# EAGLE design X16-Pi-Shield (EAGLE 9.6.2)

## Sheet 1 of 4
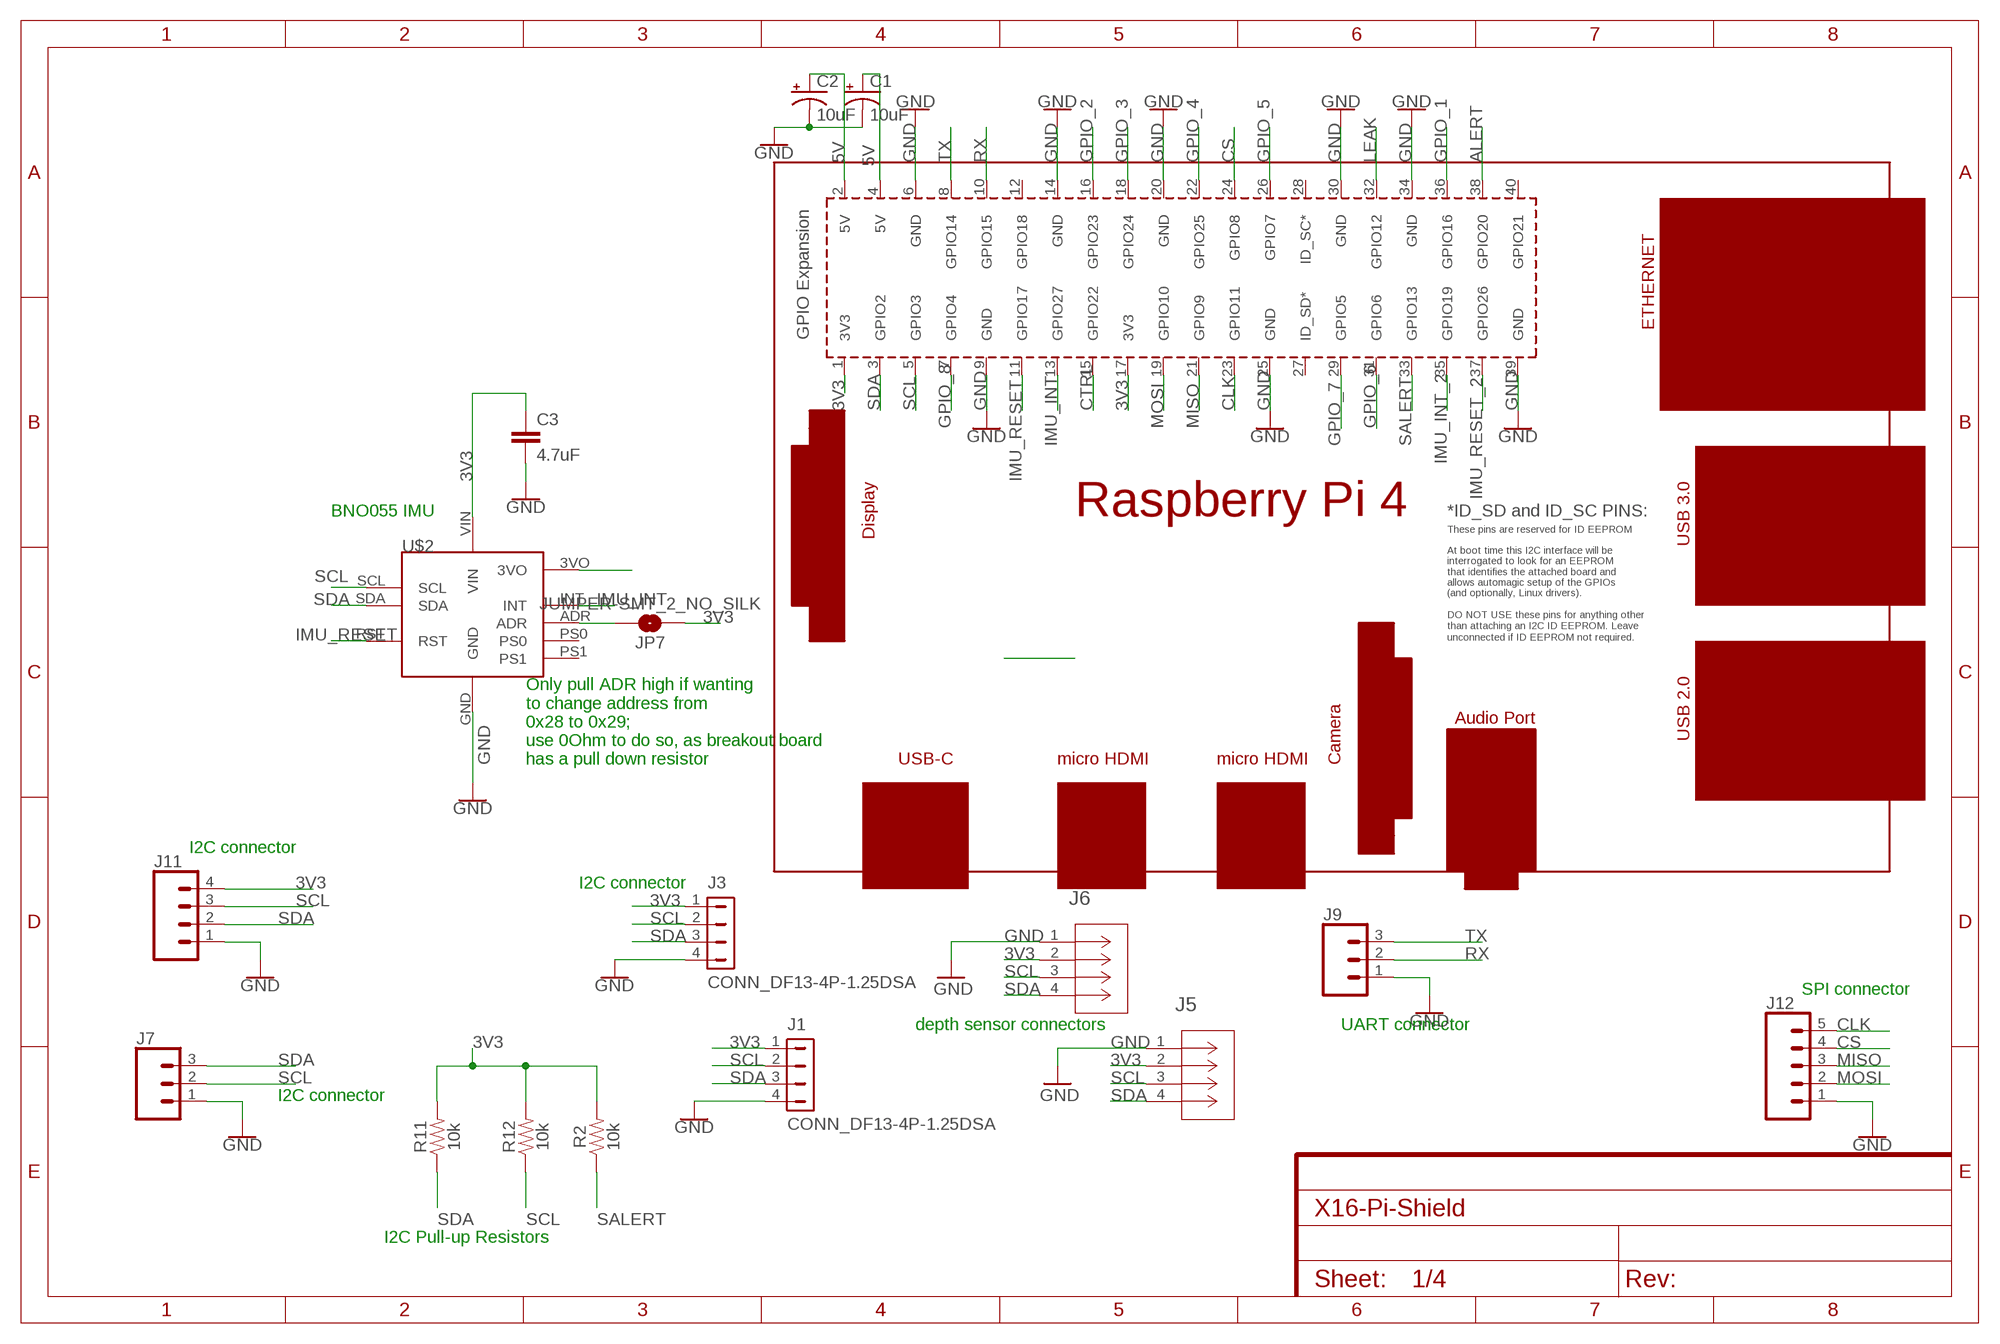
[diagram p0: schematic, sheet 1]

### Parts
C1  10uF  10UF-POLAR-0603-6.3V-20%(TANT)  [0603-POLAR]
C2  10uF  10UF-POLAR-0603-6.3V-20%(TANT)  [0603-POLAR]
C3  4.7uF  4.7UF0603  [0603]
J1  CONN_DF13-4P-1.25DSA  [DF13-4P-1.25DSA]
J3  CONN_DF13-4P-1.25DSA  [DF13-4P-1.25DSA]
J5  BM04B-GHS-TBT  [CONN_BM04B-GHS-TBT_JST]
J6  BM04B-GHS-TBT  [CONN_BM04B-GHS-TBT_JST]
J7  CONN_03  [1X03]
J9  CONN_03  [1X03]
J11  CONN_04  [1X04]
J12  CONN_05  [1X05]
JP7  JUMPER-SMT_2_NO_SILK  [SMT-JUMPER_2_NO_SILK]
R2  10k  RESISTOR0603  [0603]
R11  10k  RESISTOR0603  [0603]
R12  10k  RESISTOR0603  [0603]
U$1  RPI4  [RPI4]
U$2  CONN_ADAFRUIT-BNO055  [ADAFRUIT-BNO055]

### Nets
3V3: C3.1 J1.1 J3.1 J5.2 J6.2 J11.4 JP7.1 R2.2 R11.2 R12.2 U$1.1(3V3) U$1.17(3V3) U$2.VIN ; also sheet 2,4
5V: C1.+ C2.+ U$1.2(5V) U$1.4(5V) ; also sheet 2
ALERT: U$1.38(GPIO20) ; also sheet 2
CLK: J12.5 U$1.23(GPIO11) ; also sheet 3
CS: J12.4 U$1.24(GPIO8) ; also sheet 3
CTRL: U$1.15(GPIO22) ; also sheet 3
GND: C1.- C2.- C3.2 J1.4 J3.4 J5.1 J6.1 J7.1 J9.1 J11.1 J12.1 U$1.6(GND) U$1.9(GND) U$1.14(GND) U$1.20(GND) U$1.25(GND) U$1.30(GND) U$1.34(GND) U$1.39(GND) U$2.GND ; also sheet 2,3,4
GPIO_1: U$1.36(GPIO16) ; also sheet 3
GPIO_2: U$1.16(GPIO23) ; also sheet 3
GPIO_3: U$1.18(GPIO24) ; also sheet 3
GPIO_4: U$1.22(GPIO25) ; also sheet 3
GPIO_5: U$1.26(GPIO7) ; also sheet 3
GPIO_6: U$1.31(GPIO6) ; also sheet 3
GPIO_7: U$1.29(GPIO5) ; also sheet 3
GPIO_8: U$1.7(GPIO4) ; also sheet 3
IMU_INT: U$1.13(GPIO27) U$2.INT
IMU_INT_2: U$1.35(GPIO19) ; also sheet 4
IMU_RESET: U$1.11(GPIO17) U$2.RST
IMU_RESET_2: U$1.37(GPIO26) ; also sheet 4
LEAK: U$1.32(GPIO12) ; also sheet 4
MISO: J12.3 U$1.21(GPIO9) ; also sheet 3
MOSI: J12.2 U$1.19(GPIO10) ; also sheet 3
N$3: U$2.3VO
N$17: JP7.2 U$2.ADR
RX: J9.2 U$1.10(GPIO15)
SALERT: R2.1 U$1.33(GPIO13) ; also sheet 3
SCL: J1.2 J3.2 J5.3 J6.3 J7.2 J11.3 R12.1 U$1.5(GPIO3) U$2.SCL ; also sheet 2,3,4
SDA: J1.3 J3.3 J5.4 J6.4 J7.3 J11.2 R11.1 U$1.3(GPIO2) U$2.SDA ; also sheet 2,3,4
TX: J9.3 U$1.8(GPIO14)
Unconnected: U$1.12(GPIO18) U$1.27(ID_SD*) U$1.28(ID_SC*) U$1.40(GPIO21) U$2.PS0 U$2.PS1

### Notes on the sheet
- BNO055 IMU
- Only pull ADR high if wanting
  to change address from 
  0x28 to 0x29;
  use 0Ohm to do so, as breakout board
  has a pull down resistor
- I2C connector
- I2C connector
- SPI connector
- depth sensor connectors | UART connector
- I2C connector
- I2C Pull-up Resistors

## Sheet 2 of 4
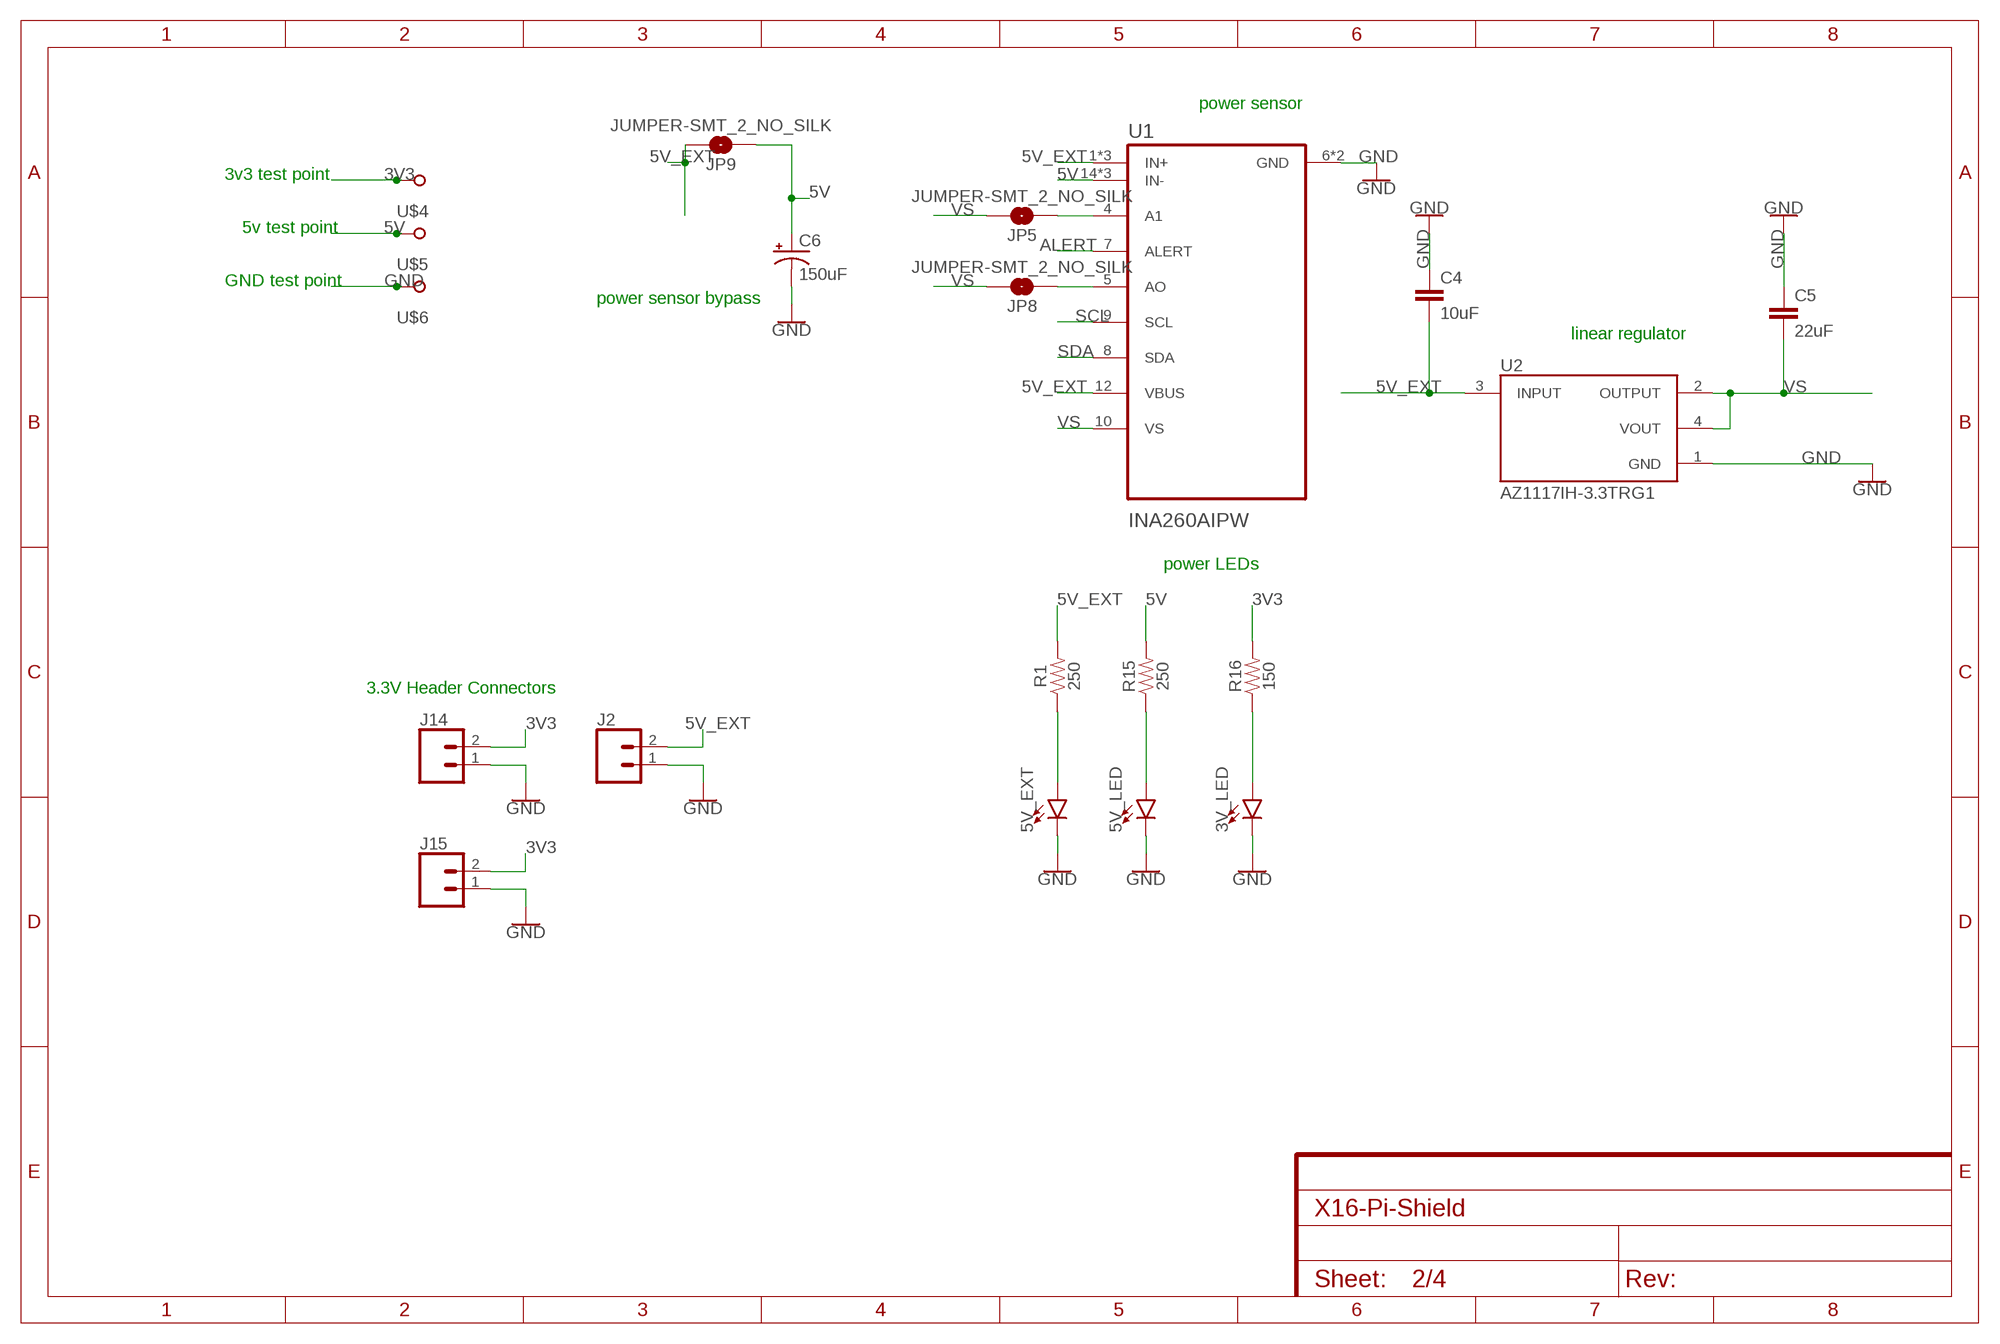
[diagram p1: schematic, sheet 2]

### Parts
3V_LED  LEDCHIPLED_0805  [CHIPLED_0805]
5V_EXT  LEDCHIPLED_0805  [CHIPLED_0805]
5V_LED  LEDCHIPLED_0805  [CHIPLED_0805]
C4  10uF  2.2UF-0603-10V-20%  [0603]
C5  22uF  2.2UF-0603-10V-20%  [0603]
C6  150uF  C-TANTALUM(10UF_150UF)  [2917(7343-31-METRIC)]
J2  CONN_02  [1X02]
J14  CONN_02  [1X02]
J15  CONN_02  [1X02]
JP5  JUMPER-SMT_2_NO_SILK  [SMT-JUMPER_2_NO_SILK]
JP8  JUMPER-SMT_2_NO_SILK  [SMT-JUMPER_2_NO_SILK]
JP9  JUMPER-SMT_2_NO_SILK  [SMT-JUMPER_2_NO_SILK]
R1  250  RESISTOR0603  [0603]
R15  250  RESISTOR0603  [0603]
R16  150  RESISTOR0603  [0603]
U1  INA260AIPW  [SOP65P640X120-16N]
U2  AZ1117IH-3.3TRG1  [SOT230P700X185-4N]
U$4  TESTPOINT_5.04MM  [TESTPOINT_5.04MM]
U$5  TESTPOINT_5.04MM  [TESTPOINT_5.04MM]
U$6  TESTPOINT_5.04MM  [TESTPOINT_5.04MM]

### Nets
3V3: J14.2 J15.2 R16.2 U$4.TP ; also sheet 1,4
5V: C6.+ JP9.1 R15.2 U1.14(IN-) U1.15(IN-) U1.16(IN-) U$5.TP ; also sheet 1
5V_EXT: C4.2 J2.2 JP9.2 R1.2 U1.1(IN+) U1.2(IN+) U1.3(IN+) U1.12(VBUS) U2.3(INPUT) ; also sheet 3
ALERT: U1.7(ALERT) ; also sheet 1
GND: 3V_LED.C 5V_EXT.C 5V_LED.C C4.1 C5.1 C6.- J2.1 J14.1 J15.1 U1.6(GND) U1.11(GND) U2.1(GND) U$6.TP ; also sheet 1,3,4
N$1: JP5.1 U1.4(A1)
N$2: JP8.1 U1.5(AO)
N$6: 5V_EXT.A R1.1
N$7: 5V_LED.A R15.1
N$9: 3V_LED.A R16.1
SCL: U1.9(SCL) ; also sheet 1,3,4
SDA: U1.8(SDA) ; also sheet 1,3,4
VS: C5.2 JP5.2 JP8.2 U1.10(VS) U2.2(OUTPUT) U2.4(VOUT)

### Notes on the sheet
- power sensor
- 3v3 test point
- 5v test point
- GND test point
- power sensor bypass
- linear regulator
- power LEDs
- 3.3V Header Connectors

## Sheet 3 of 4
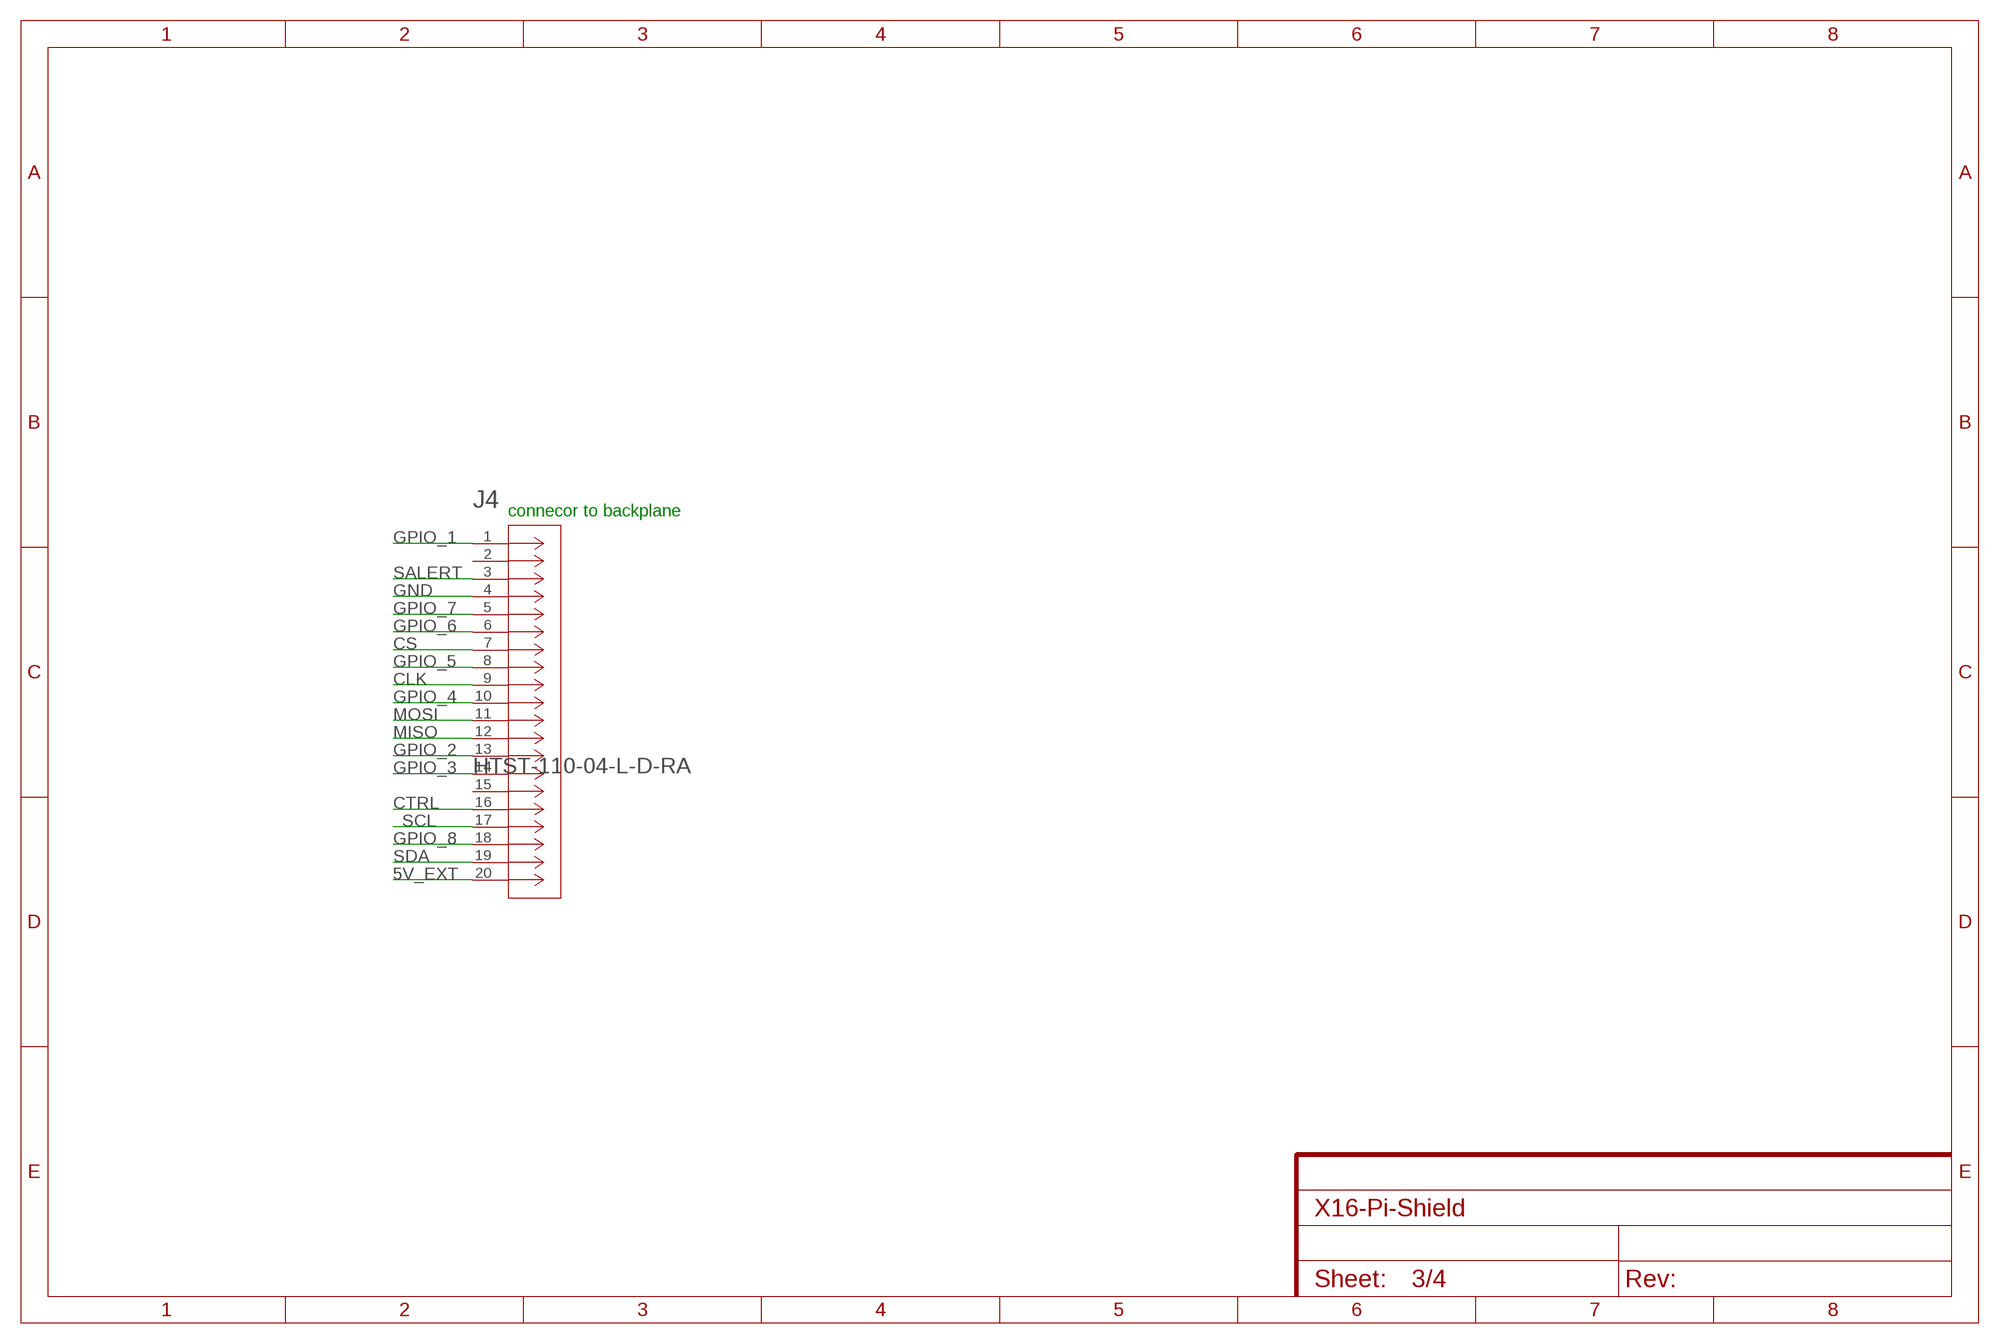
[diagram p2: schematic, sheet 3]

### Parts
J4  HTST-110-04-L-D-RA  [CONN_HTST-110-04/05-X-D-RA_SAI]

### Nets
5V_EXT: J4.20 ; also sheet 2
CLK: J4.9 ; also sheet 1
CS: J4.7 ; also sheet 1
CTRL: J4.16 ; also sheet 1
GND: J4.4 ; also sheet 1,2,4
GPIO_1: J4.1 ; also sheet 1
GPIO_2: J4.13 ; also sheet 1
GPIO_3: J4.14 ; also sheet 1
GPIO_4: J4.10 ; also sheet 1
GPIO_5: J4.8 ; also sheet 1
GPIO_6: J4.6 ; also sheet 1
GPIO_7: J4.5 ; also sheet 1
GPIO_8: J4.18 ; also sheet 1
MISO: J4.12 ; also sheet 1
MOSI: J4.11 ; also sheet 1
SALERT: J4.3 ; also sheet 1
SCL: J4.17 ; also sheet 1,2,4
SDA: J4.19 ; also sheet 1,2,4
Unconnected: J4.2 J4.15

### Notes on the sheet
- connecor to backplane

## Sheet 4 of 4
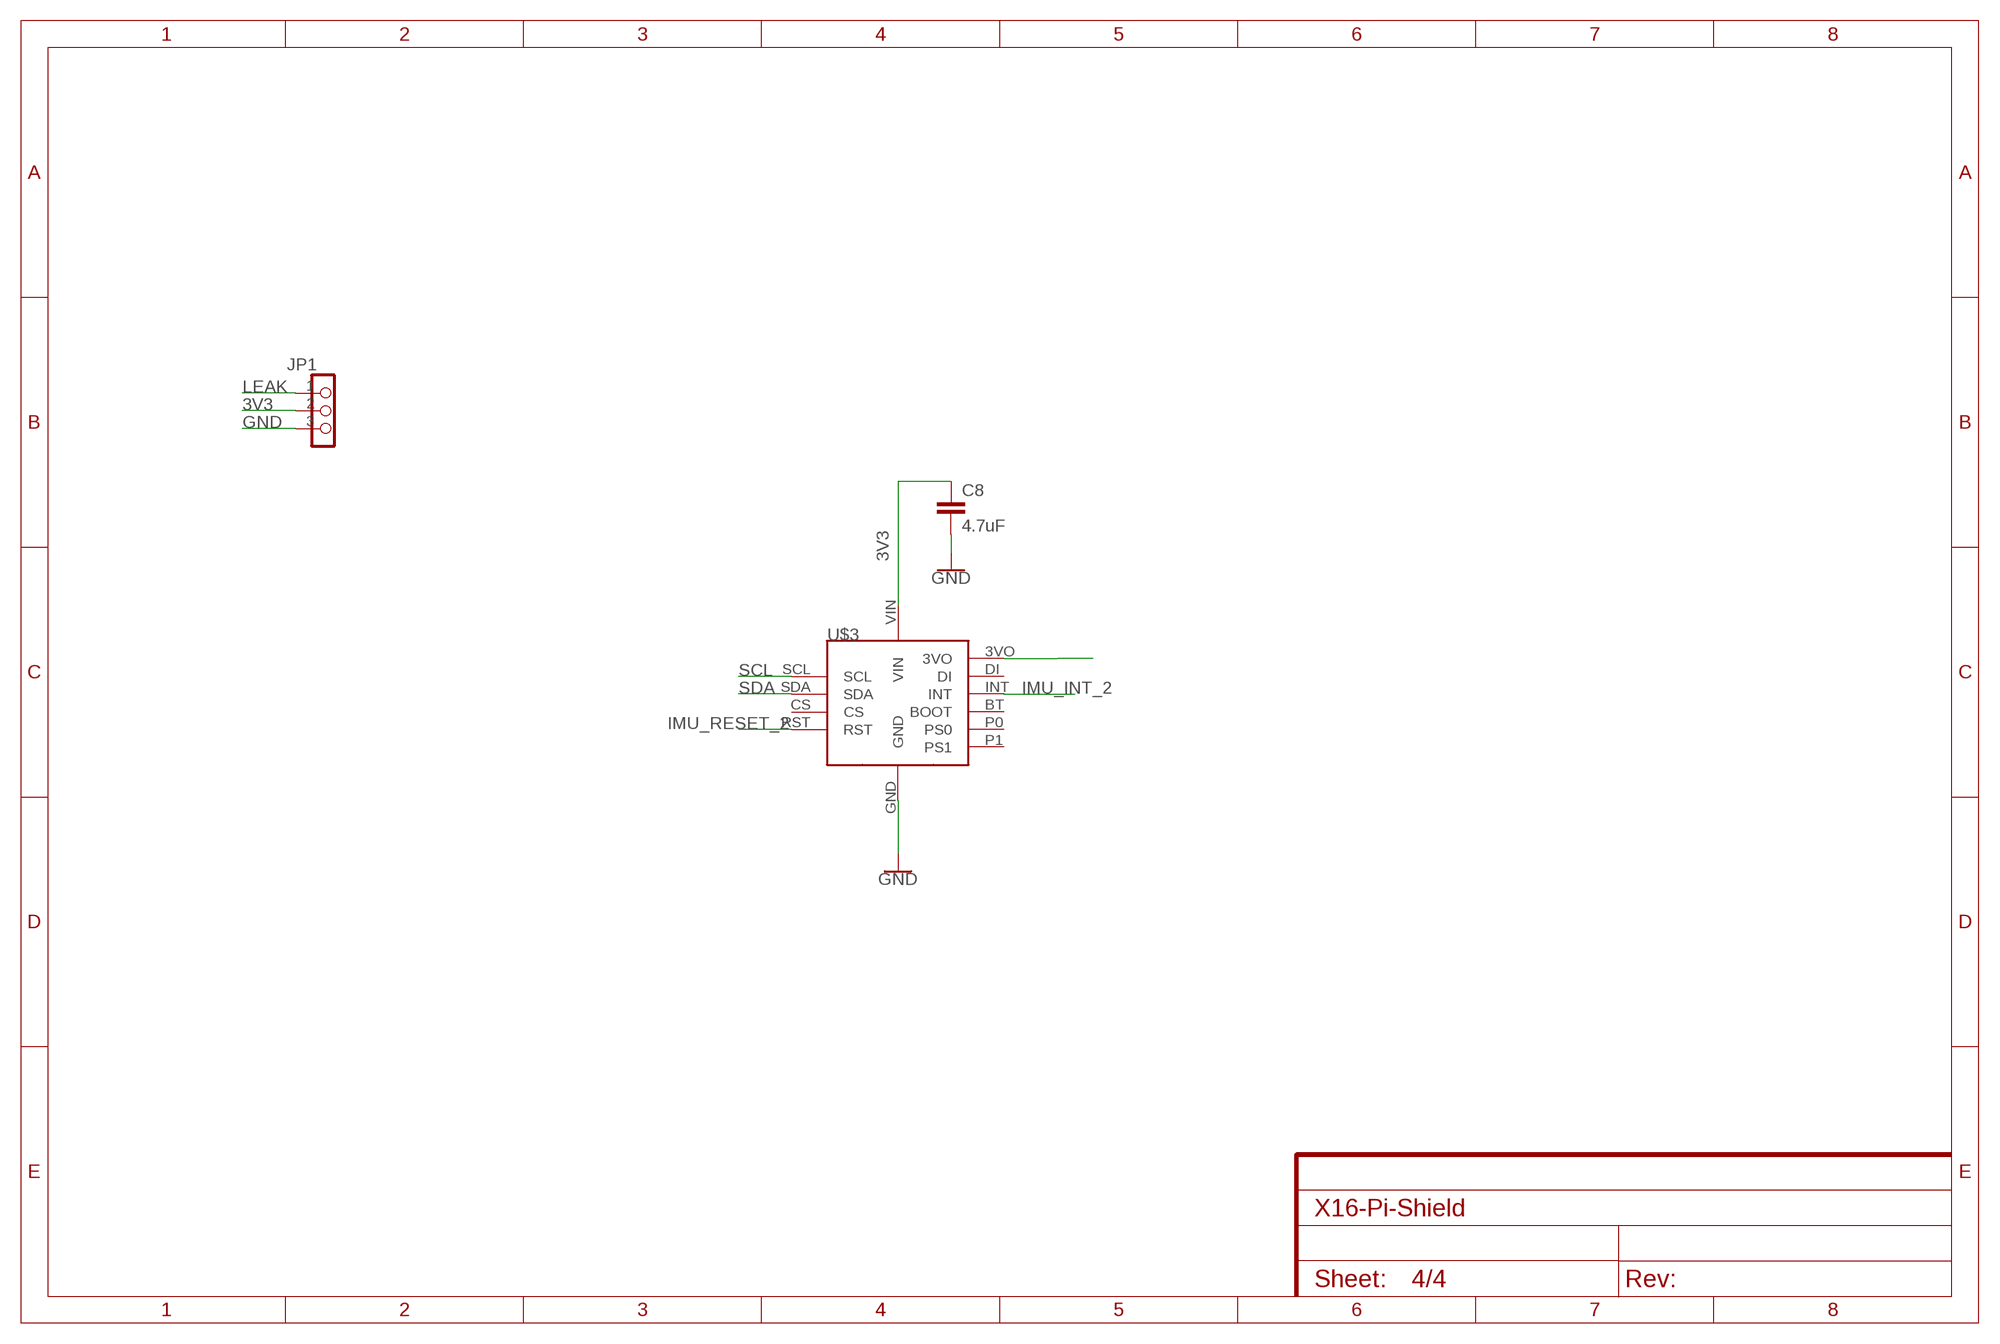
[diagram p3: schematic, sheet 4]

### Parts
C8  4.7uF  4.7UF0603  [0603]
JP1  TEST_PIN-1X3  [1X03]
U$3  ADAFRUIT-BNO080  [ADAFRUIT-BNO080]

### Nets
3V3: C8.1 JP1.2 U$3.VIN ; also sheet 1,2
GND: C8.2 JP1.3 U$3.GND ; also sheet 1,2,3
IMU_INT_2: U$3.INT ; also sheet 1
IMU_RESET_2: U$3.RST ; also sheet 1
LEAK: JP1.1 ; also sheet 1
N$5: U$3.3VO
SCL: U$3.SCL ; also sheet 1,2,3
SDA: U$3.SDA ; also sheet 1,2,3
Unconnected: U$3.BT(BOOT) U$3.CS U$3.DI U$3.P0(PS0) U$3.P1(PS1)

## Library data of the parts
3V_LED 5V_EXT 5V_LED = led:LED: LED OSRAM: - CHIPLED LG R971, LG N971, LY N971, LG Q971, LY Q971, LO R971, LY R971 LH N974, LH R974 LS Q976, LO Q976, LY Q976 LO Q996 - Hyper CHIPLED LW Q18S LB Q993, LB Q99A, LB R99A - SideLED LS A670, LO A670, LY A670, LG A670, LP A670 LB A673, LV A673, LT A673, LW A673 LH A674 LY A675 LS A676, LA A676, LO A676, LY A676, LW A676 LS A679, LY A679, LG A679 - Hyper Micro SIDELED® LS Y876, LA Y876, LO Y876, LY Y876 LT Y87S - SmartLED LW L88C, LW L88S LB L89C, LB L89S, LG L890 LS L89K, LO L89K, LY L89K LS L896, LA L896, LO L896, LY L896 - TOPLED LS T670, LO T670, LY T670, LG T670, LP T670 LSG T670, LSP T670, LSY T670, LOP T670, LYG T670 LG T671, LOG T671, LSG T671 LB T673, LV T673, LT T673, LW T673 LH T674 LS T676, LA T676, LO T676, LY T676, LB T676, LH T676, LSB T676, LW T676 LB T67C, LV T67C, LT T67C, LS T67K, LO T67K, LY T67K, LW E67C LS E67B, LA E67B, LO E67B, LY E67B, LB E67C, LV E67C, LT E67C LW T67C LS T679, LY T679, LG T679 LS T770, LO T770, LY T770, LG T770, LP T770 LB T773, LV T773, LT T773, LW T773 LH T774 LS E675, LA E675, LY E675, LS T675 LS T776, LA T776, LO T776, LY T776, LB T776 LHGB T686 LT T68C, LB T68C - Hyper Mini TOPLED® LB M676 - Mini TOPLED Santana® LG M470 LS M47K, LO M47K, LY M47K Source: http://www.osram.convergy.de LUXEON: - LUMILED® LXK2-PW12-R00, LXK2-PW12-S00, LXK2-PW14-U00, LXK2-PW14-V00 LXK2-PM12-R00, LXK2-PM12-S00, LXK2-PM14-U00 LXK2-PE12-Q00, LXK2-PE12-R00, LXK2-PE12-S00, LXK2-PE14-T00, LXK2-PE14-U00 LXK2-PB12-K00, LXK2-PB12-L00, LXK2-PB12-M00, LXK2-PB14-N00, LXK2-PB14-P00, LXK2-PB14-Q00 LXK2-PR12-L00, LXK2-PR12-M00, LXK2-PR14-Q00, LXK2-PR14-R00 LXK2-PD12-Q00, LXK2-PD12-R00, LXK2-PD12-S00 LXK2-PH12-R00, LXK2-PH12-S00 LXK2-PL12-P00, LXK2-PL12-Q00, LXK2-PL12-R00 Source: www.luxeon.com KINGBRIGHT: KA-3528ASYC Source: www.kingbright.com
C1 C2 = SparkFun-Capacitors:10UF-POLAR: 10.0µF polarized capacitors A capacitor is a passive two-terminal electrical component used to store electrical energy temporarily in an electric field.; PROD_ID: CAP-13210
C3 C8 = SparkFun-Capacitors:4.7UF: 4.7µF ceramic capacitors A capacitor is a passive two-terminal electrical component used to store electrical energy temporarily in an electric field.; PROD_ID: CAP-08280
C4 C5 = SparkFun-Capacitors:2.2UF: 2.2µF ceramic capacitors A capacitor is a passive two-terminal electrical component used to store electrical energy temporarily in an electric field.; PROD_ID: CAP-07888; VALUE: 2.2uF
C6 = X15-Pi-Shield-Parts:C-TANTALUM(10UF_150UF)
J1 J3 = X16-Pi-Shield:CONN_DF13-4P-1.25: DF13-4P 1.25mm Pitch Miniature Crimping Connector.
J2 J14 J15 = SparkFun-Connectors:CONN_02: Multi connection point. Often used as Generic Header-pin footprint for 0.1 inch spaced/style header connections On any of the 0.1 inch spaced packages, you can populate with these: Break Away Headers - Straight <https://www.sparkfun.com/products/116> (PRT-00116) Break Away Male Headers - Right Angle <https://www.sparkfun.com/products/553> (PRT-00553) Female Headers <https://www.sparkfun.com/products/115> (PRT-00115) Break Away Headers - Machine Pin <https://www.sparkfun.com/products/117> (PRT-00117) Break Away Female Headers - Swiss Machine Pin <https://www.sparkfun.com/products/743> (PRT-00743) For SCREWTERMINALS and SPRING TERMINALS visit here: Screw Terimnals on SparkFun.com <https://www.sparkfun.com/search/results?term=Screw+Terminals> (5mm/3.5mm/2.54mm spacing) This device is also useful as a general connection point to wire up your design to another part of your project. Our various solder wires solder well into these plated through hole pads. Hook-Up Wire - Assortment (Stranded, 22 AWG) <https://www.sparkfun.com/products/11375> (PRT-11375) Hook-Up Wire - Assortment (Solid Core, 22 AWG) <https://www.sparkfun.com/products/11367> (PRT-11367) View the entire wire category on our website here <https://www.sparkfun.com/categories/141> Special notes: Molex polarized connector foot print use with: PRT-08233 with associated crimp pins and housings. 2.54_SCREWTERM for use with PRT-10571. 3.5mm Screw Terminal footprints for PRT-08084 5mm Screw Terminal footprints for use with PRT-08432
J4 = X16-Pi-Shield:HTST-110-04-L-D-RA; COPYRIGHT: Copyright (C) 2023 Ultra Librarian. All rights reserved.; MANUFACTURER_PART_NUMBER: HTST-110-04-L-D-RA; MFR_NAME: Samtec Inc; TYPE: Headers, Male Pins
J5 J6 = X16-Pi-Shield:BM04B-GHS-TBT; COPYRIGHT: Copyright (C) 2023 Ultra Librarian. All rights reserved.; MANUFACTURER_PART_NUMBER: BM04B-GHS-TBT; MFR_NAME: JST
J7 J9 = SparkFun-Connectors:CONN_03: Multi connection point. Often used as Generic Header-pin footprint for 0.1 inch spaced/style header connections On any of the 0.1 inch spaced packages, you can populate with these: Break Away Headers - Straight <https://www.sparkfun.com/products/116> (PRT-00116) Break Away Male Headers - Right Angle <https://www.sparkfun.com/products/553> (PRT-00553) Female Headers <https://www.sparkfun.com/products/115> (PRT-00115) Break Away Headers - Machine Pin <https://www.sparkfun.com/products/117> (PRT-00117) Break Away Female Headers - Swiss Machine Pin <https://www.sparkfun.com/products/743> (PRT-00743) Stackable Header - 3 Pin (Female, 0.1") <https://www.sparkfun.com/products/13875> (PRT-13875) For SCREWTERMINALS and SPRING TERMINALS visit here: Screw Terimnals on SparkFun.com <https://www.sparkfun.com/search/results?term=Screw+Terminals> (5mm/3.5mm/2.54mm spacing) This device is also useful as a general connection point to wire up your design to another part of your project. Our various solder wires solder well into these plated through hole pads. Hook-Up Wire - Assortment (Stranded, 22 AWG) <https://www.sparkfun.com/products/11375> (PRT-11375) Hook-Up Wire - Assortment (Solid Core, 22 AWG) <https://www.sparkfun.com/products/11367> (PRT-11367) View the entire wire category on our website here <https://www.sparkfun.com/categories/141> Special notes: Molex polarized connector foot print use with SKU : PRT-08232 with associated crimp pins and housings.
J11 = SparkFun-Connectors:CONN_04: Multi connection point. Often used as Generic Header-pin footprint for 0.1 inch spaced/style header connections On any of the 0.1 inch spaced packages, you can populate with these: Break Away Headers - Straight <https://www.sparkfun.com/products/116> (PRT-00116) Break Away Male Headers - Right Angle <https://www.sparkfun.com/products/553> (PRT-00553) Female Headers <https://www.sparkfun.com/products/115> (PRT-00115) Break Away Headers - Machine Pin <https://www.sparkfun.com/products/117> (PRT-00117) Break Away Female Headers - Swiss Machine Pin <https://www.sparkfun.com/products/743> (PRT-00743) For SCREWTERMINALS and SPRING TERMINALS visit here: Screw Terimnals on SparkFun.com <https://www.sparkfun.com/search/results?term=Screw+Terminals> (5mm/3.5mm/2.54mm spacing) This device is also useful as a general connection point to wire up your design to another part of your project. Our various solder wires solder well into these plated through hole pads. Hook-Up Wire - Assortment (Stranded, 22 AWG) <https://www.sparkfun.com/products/11375> (PRT-11375) Hook-Up Wire - Assortment (Solid Core, 22 AWG) <https://www.sparkfun.com/products/11367> (PRT-11367) View the entire wire category on our website here <https://www.sparkfun.com/categories/141> Special notes: Molex polarized connector foot print use with SKU : PRT-08231 with associated crimp pins and housings. 1MM SMD Version SKU: PRT-10208; PROD_ID: CONN-09696
J12 = SparkFun-Connectors:CONN_05: Multi connection point. Often used as Generic Header-pin footprint for 0.1 inch spaced/style header connections On any of the 0.1 inch spaced packages, you can populate with these: Break Away Headers - Straight <https://www.sparkfun.com/products/116> (PRT-00116) Break Away Male Headers - Right Angle <https://www.sparkfun.com/products/553> (PRT-00553) Female Headers <https://www.sparkfun.com/products/115> (PRT-00115) Break Away Headers - Machine Pin <https://www.sparkfun.com/products/117> (PRT-00117) Break Away Female Headers - Swiss Machine Pin <https://www.sparkfun.com/products/743> (PRT-00743) For SCREWTERMINALS and SPRING TERMINALS visit here: Screw Terimnals on SparkFun.com <https://www.sparkfun.com/search/results?term=Screw+Terminals> (5mm/3.5mm/2.54mm spacing) This device is also useful as a general connection point to wire up your design to another part of your project. Our various solder wires solder well into these plated through hole pads. Hook-Up Wire - Assortment (Stranded, 22 AWG) <https://www.sparkfun.com/products/11375> (PRT-11375) Hook-Up Wire - Assortment (Solid Core, 22 AWG) <https://www.sparkfun.com/products/11367> (PRT-11367) View the entire wire category on our website here <https://www.sparkfun.com/categories/141> Special notes: Molex polarized connector foot print use with SKU : PRT-08231 with associated crimp pins and housings. 1MM SMD Version SKU: PRT-10208
JP1 = X16-ExtraComponents:TEST_PIN-1X3: PIN HEADER
JP5 JP7-JP9 = SparkFun-Jumpers:JUMPER-SMT_2_NO: Normally open jumper This jumper has two pads in close proximity to each other. Apply solder to close the connection. Round pads are easier to solder for beginners, but are a lot larger. SparkFun Product that uses the round pads: SparkFun EL Sequencer <https://www.sparkfun.com/products/12781>
R1 R2 R11 R12 R15 R16 = SparkFun-Resistors:RESISTOR: Generic Resistor Package
U1 = X16-Pi-Shield:INA260AIPW
U2 = X16-Pi-Shield:AZ1117IH-3.3TRG1; MANUFACTURER: Diodes Inc.; MAXIMUM_PACKAGE_HEIGHT: 1.85 mm; PARTREV: 2-2; SNAPEDA_PACKAGE_ID: 6532; SNAPEDA_PN: AZ1117IH-3.3TRG1; STANDARD: IPC 7351B
U$1 = X16-Pi-Shield:RPI4
U$2 = X16-Pi-Shield:CONN_ADAFRUIT-BNO055
U$3 = X16-Pi-Shield:ADAFRUIT-BNO080
U$4-U$6 = X16-ExtraComponents:TESTPOINT_5.04MM: TEST PIN

## Net classes
2 lowpower: width 0.254 mm, drill 0.381 mm

## Board
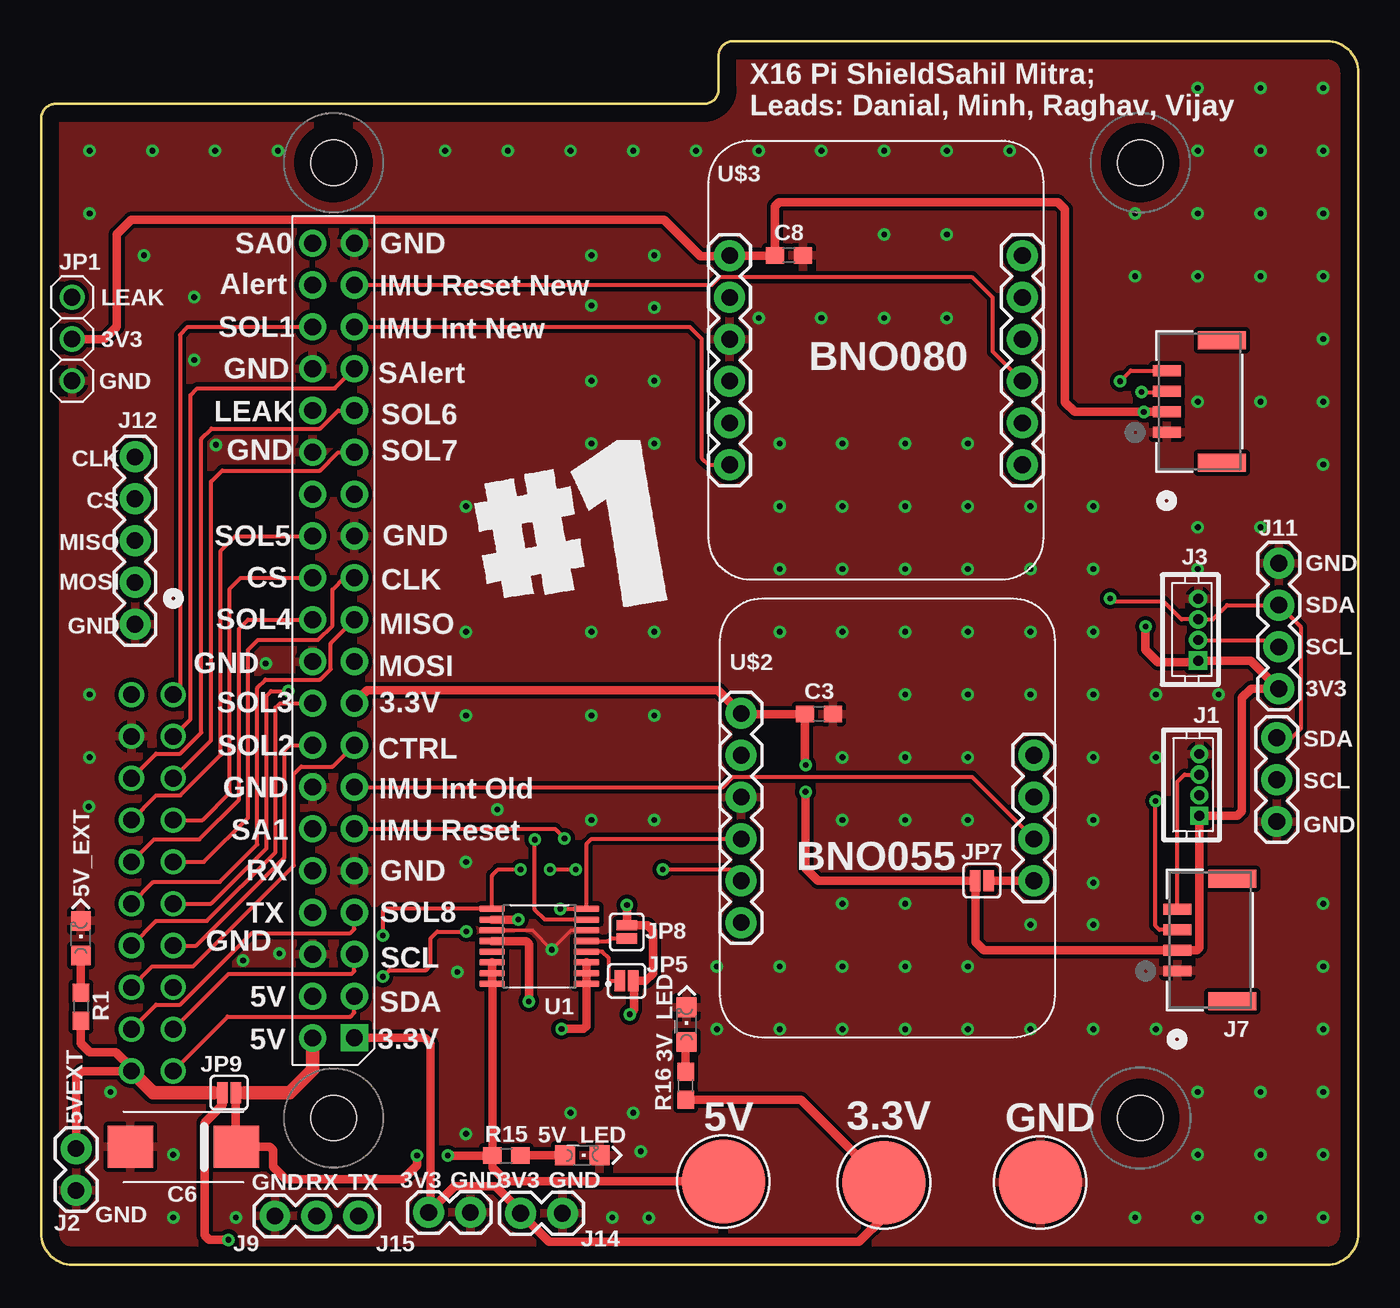
[diagram p4: board, top side]
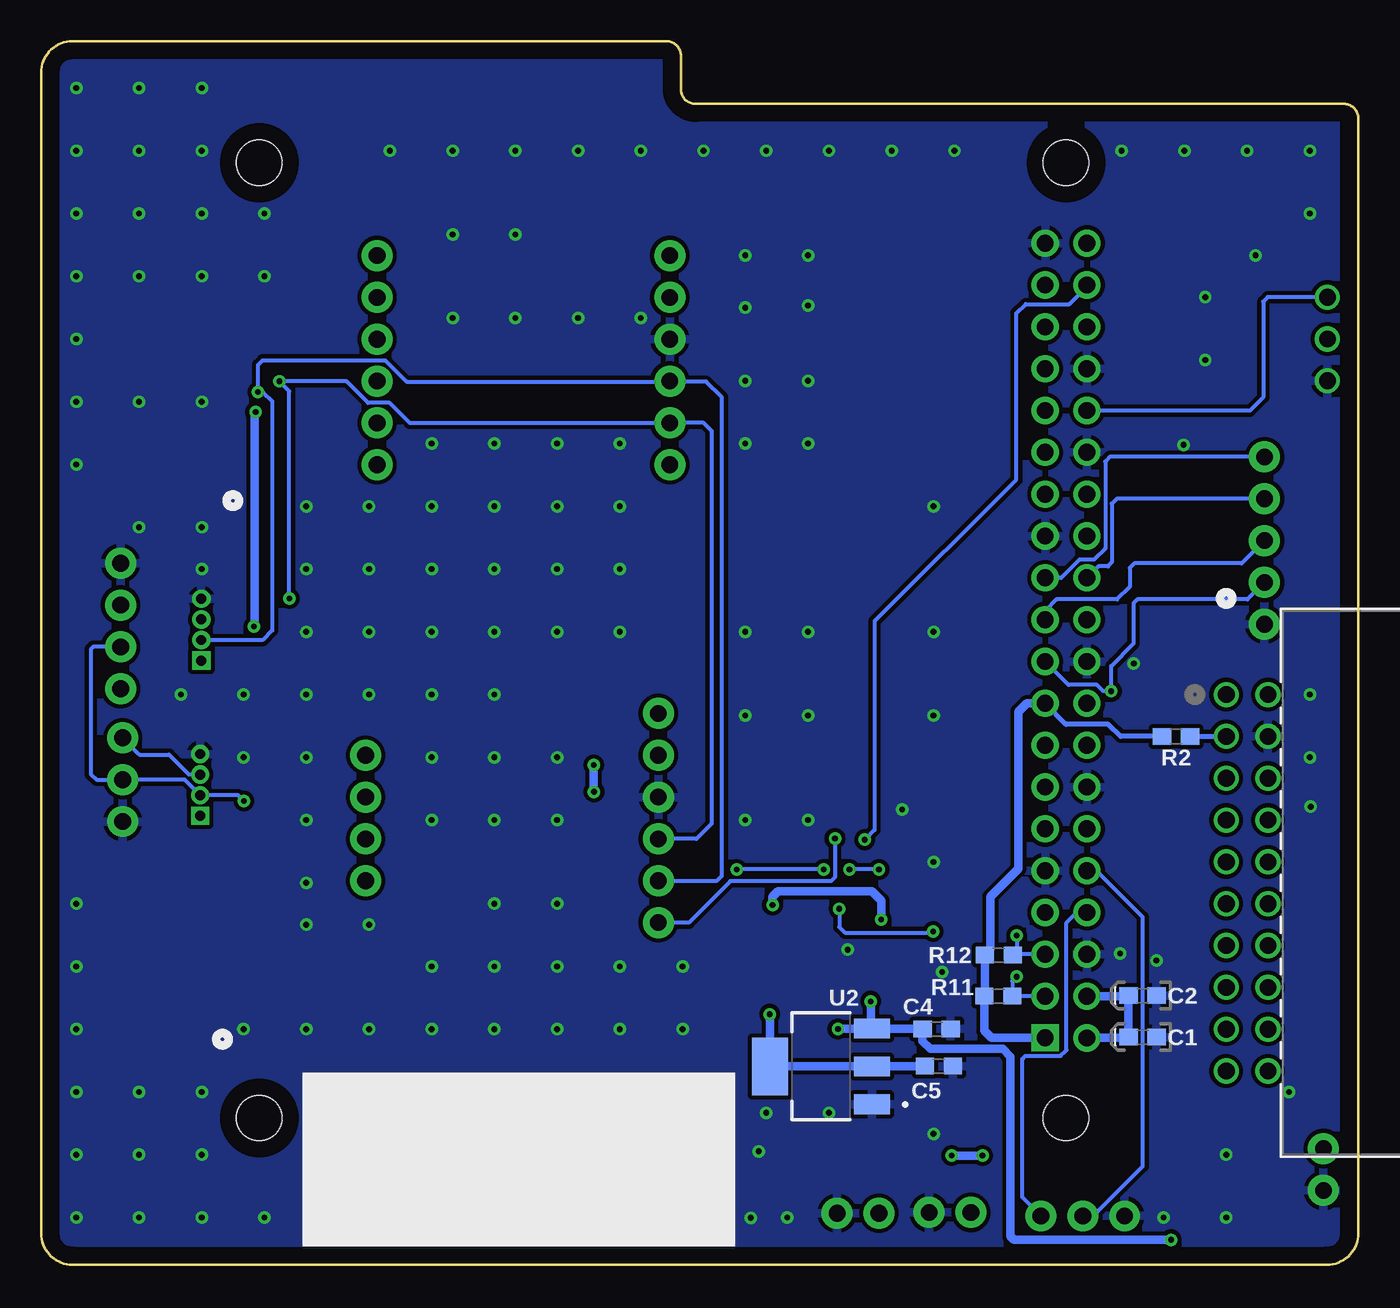
[diagram p5: board, bottom side, seen from below]

Size 80.01 x 74.3 mm. Coordinates in mm from the lower left corner, seen from the top.
Outline: 0,1.91 0,69.6 arc-90 0.89,70.49 40.26,70.49 arc90 41.15,71.37 41.15,73.41 arc-90 42.04,74.3 78.11,74.3 arc-90 80.01,72.39 80.01,1.91 arc-90 78.11,0 1.91,0 arc-90 0,1.91
Copper layers (1*16): Top 0.035mm / dielectric 1.5mm / Bottom 0.035mm
Design rules "477": minimum track width 6mil, minimum drill 0.35mm, track to track 6mil, track to pad 6mil, pad to pad 6mil, via to via 6mil, smd to smd 6mil, copper to edge 40mil, drill to drill 6mil, minimum pad ring 10mil, minimum via ring 8mil, stop-mask expansion 4mil, vias tented up to drill 0mil, thermal gap 10mil

### Footprints (pad centres in the part's own frame; a part is rotated, then mirrored left to right if it is on the bottom)
CHIPLED_0805 = smd 1.2 x 1.2: A 0,-1.05; C 0,1.05
0603-POLAR = smd 1.1 x 1: + 0.85,0; - -0.85,0
0603 = smd 1.1 x 1: 1 -0.85,0; 2 0.85,0
2917(7343-31-METRIC) = smd 2.77 x 2.55: + -3.22,0; - 3.22,0
DF13-4P-1.25DSA = drill 0.6 pad 0.889 square: 1 1.875,0 | drill 0.6 pad 0.889: 2 0.625,0; 3 -0.625,0; 4 -1.875,0
1X02 = drill 1.016 pad 1.88: 1 0,0; 2 2.54,0
CONN_HTST-110-04/05-X-D-RA_SAI = drill 1.016 pad 1.524: 1 0,0; 2 0,-2.54; 3 -2.54,0; 4 -2.54,-2.54; 5 -5.08,0; 6 -5.08,-2.54; 7 -7.62,0; 8 -7.62,-2.54; 9 -10.16,0; 10 -10.16,-2.54; 11 -12.7,0; 12 -12.7,-2.54; 13 -15.24,0; 14 -15.24,-2.54; 15 -17.78,0; 16 -17.78,-2.54; 17 -20.32,0; 18 -20.32,-2.54; 19 -22.86,0; 20 -22.86,-2.54
CONN_BM04B-GHS-TBT_JST = smd 0.66 x 1.702: 1 -1.875,1.976; 2 -0.625,1.976; 3 0.625,1.976; 4 1.875,1.976 | smd 1.092 x 2.896: 5 -3.725,-1.373; 6 3.725,-1.373
1X03 = drill 1.016 pad 1.88: 1 0,0; 2 2.54,0; 3 5.08,0
1X04 = drill 1.016 pad 1.88: 1 0,0; 2 2.54,0; 3 5.08,0; 4 7.62,0
1X05 = drill 1.016 pad 1.88: 1 0,0; 2 2.54,0; 3 5.08,0; 4 7.62,0; 5 10.16,0
1X03' = drill 1.016: 1 -2.54,0; 2 0,0; 3 2.54,0
SMT-JUMPER_2_NO_SILK = smd 0.635 x 1.27: 1 -0.406,0; 2 0.406,0
SOP65P640X120-16N = smd 1.57 x 0.41: 1 -2.87,2.275; 2 -2.87,1.625; 3 -2.87,0.975; 4 -2.87,0.325; 5 -2.87,-0.325; 6 -2.87,-0.975; 7 -2.87,-1.625; 8 -2.87,-2.275; 9 2.87,-2.275; 10 2.87,-1.625; 11 2.87,-0.975; 12 2.87,-0.325; 13 2.87,0.325; 14 2.87,0.975; 15 2.87,1.625; 16 2.87,2.275
SOT230P700X185-4N = smd 2.2 x 1.2: 1 -3.1,2.3; 2 -3.1,0; 3 -3.1,-2.3 | smd 2.2 x 3.5: 4 3.1,0
RPI4 = drill 1.016 pad 1.651 square: 1 8.37,51.23 | drill 1.016 pad 1.651: 2 8.357,53.772; 3 10.897,51.232; 4 10.897,53.772; 5 13.437,51.232; 6 13.437,53.772; 7 15.977,51.232; 8 15.977,53.772; 9 18.517,51.232; 10 18.517,53.772; 11 21.057,51.232; 12 21.057,53.772; 13 23.597,51.232; 14 23.597,53.772; 15 26.137,51.232; 16 26.137,53.772; 17 28.677,51.232; 18 28.677,53.772; 19 31.217,51.232; 20 31.217,53.772; 21 33.757,51.232; 22 33.757,53.772; 23 36.297,51.232; 24 36.297,53.772; 25 38.837,51.232; 26 38.837,53.772; 27 41.377,51.232; 28 41.377,53.772; 29 43.917,51.232; 30 43.917,53.772; 31 46.457,51.232; 32 46.457,53.772; 33 48.997,51.232; 34 48.997,53.772; 35 51.537,51.232; 36 51.537,53.772; 37 54.077,51.232; 38 54.077,53.772; 39 56.617,51.232; 40 56.617,53.772 | hole 2.75: 3.5,3.5; 61.5,3.5; 3.5,52.5; 61.5,52.5
ADAFRUIT-BNO055 = drill 1.016 pad 1.88: 3VO 9.525,1.27; ADR 17.145,19.05; GND 12.065,1.27; INT 14.605,19.05; PS0 9.525,19.05; PS1 12.065,19.05; RST 19.685,1.27; SCL 17.145,1.27; SDA 14.605,1.27; VIN 6.985,1.27
ADAFRUIT-BNO080 = drill 1.016 pad 1.88: 3VO -3.175,-8.89; BT -5.715,8.89; CS 6.985,8.89; DI 4.445,8.89; GND -0.635,-8.89; INT 6.985,-8.89; P0 -3.175,8.89; P1 -0.635,8.89; RST 1.905,8.89; SCL 1.905,-8.89; SDA 4.445,-8.89; VIN -5.715,-8.89
TESTPOINT_5.04MM = smd 5.08 x 5.08: TP 0,0

### Placement (x,y rotation side)
3V_LED  39.2,14.58 0 top
5V_EXT  2.41,19.82 0 top
5V_LED  32.87,6.64 270 top
C1  13.11,13.82 180 bottom
C2  13.11,16.34 180 bottom
C3  47.26,33.44 0 top
C4  25.62,14.31 180 bottom
C5  25.49,12.05 180 bottom
C6  8.64,7.15 180 top
C8  45.43,61.29 0 top
J1  70.36,29.13 270 top
J2  2.12,4.51 90 top
J3  70.28,38.56 270 top
J4  8.03,34.62 90 bottom
J5  70.35,52.41 90 top
J6  70.98,19.71 90 top
J7  75.06,26.91 90 top
J9  14.2,2.96 0 top
J11  75.18,42.6 270 top
J12  5.7,38.89 90 top
J14  31.66,3.12 180 top
J15  26.07,3.17 180 top
JP1  [1X03']  1.88,56.21 270 top
JP5  35.56,17.23 0 top
JP7  57.15,23.32 0 top
JP8  35.57,20.21 90 top
JP9  11.42,10.45 180 top
R1  2.41,15.67 270 top
R2  11.07,32.08 180 bottom
R11  21.87,16.31 180 bottom
R12  21.84,18.81 180 bottom
R15  28.26,6.63 180 top
R16  39.14,10.87 270 top
U1  30.26,19.33 180 top
U2  32.64,12.04 180 bottom
U$1  70.26,5.41 90 top
U$2  41.25,40.46 270 top
U$3  50.71,55.56 270 top
U$4  51.19,4.98 0 top
U$5  41.44,5.05 0 top
U$6  60.69,5 0 top

### Tracks (layer width: path | path; a pad name or v marks a point on that pad's centre or on a via)
3V3  (via drill 0.35)
  Top 0.508: J5.2 68.36,51.78 v66.98,51.78 62.78,51.78 62.19,52.36 62.19,64.08 61.75,64.53 44.83,64.53 44.58,64.28 C8.1 44.57,61.28 U$3.VIN 41.77,61.23 40.06,61.23 37.83,63.45 5.47,63.45 4.58,62.56 4.58,56.96 3.84,56.21 JP1.2 | v67.08,38.75 67.08,37.35 67.84,36.59 70.19,36.59 J3.1 73.48,36.68 J11.4 73.5,34.98 72.94,34.42 72.94,27.55 72.65,27.26 J1.1 70.36,19.24 70.2,19.09 J6.2 57.25,19.09 56.74,19.6 JP7.1 47.19,23.32 46.43,24.08 v46.43,28.71 | v46.44,30.34 46.41,30.38 C3.1 42.56,33.44 U$2.VIN 41.12,34.87 19.81,34.87 U$1.17 | U$1.1 23.29,13.78 23.65,13.43 23.65,3.29 J15.2 25.12,4.76 27.61,4.76 29.12,3.25 J14.2 30.86,1.38 49.68,1.38 51.19,2.9 U$4.TP 46.15,10.02 R16.2
  Bottom 0.305: R2.2 14.44,32.08 15.18,32.82 17.75,32.82 U$1.17
  Bottom 0.508: U$1.1 22.3,13.78 22.72,14.2 R11.2 22.69,16.33 R12.2 22.34,19.16 22.34,22.35 20.64,24.05 20.64,33.58 20.13,34.09 U$1.17 | v67.08,38.75 67.06,38.77 67.06,51.7 v66.98,51.78 | v46.44,30.34 46.44,28.73 v46.43,28.71
5V  (via drill 0.35)
  Top 0.508: C6.+ 11.82,7.18 JP9.1 12.37,10.44 | C6.+ | U1.14 U1.15 U1.16 27.41,17.04 R15.2 | U$5.TP 28.25,5.05 27.41,5.9 R15.2 | R15.2 v24.7,6.63 | v22.83,6.63 22.83,6.03 22,5.19 14.85,5.19 14.08,5.96 14.08,6.96 13.89,7.16 C6.+
  Top 0.813: 12.37,10.44 15.09,10.44 16.48,11.84 U$1.2
  Bottom 0.508: U$1.2 14.01,13.77 C1.+ C2.+ 13.99,16.31 U$1.4 | v24.7,6.63 v22.83,6.63
5V_EXT  (via drill 0.35)
  Top 0.508: J2.2 2.12,11.4 2.48,11.76 J4.20 5.49,11.95 4.52,12.92 2.95,12.92 2.41,13.45 R1.2 | U1.3 U1.2 U1.1 33.13,14.49 32.96,14.31 v31.61,14.31 | U1.12 29.46,19.65 29.64,19.47 29.64,16.02 v29.62,15.99 | v11.38,1.51 10.21,1.51 9.94,1.78 9.94,8.63 11.01,9.7 JP9.2 10.49,10.44
  Top 0.813: J4.20 6.81,10.44 10.49,10.44
  Bottom 0.508: v31.61,14.31 29.57,14.31 | 29.57,14.31 U2.3 29.51,14.31 C4.2 26.47,13.58 26,13.11 21.6,13.11 21.13,12.64 21.13,1.71 20.93,1.51 v11.38,1.51 | v29.62,15.99 29.62,14.36 29.57,14.31
ALERT  (via drill 0.35)
  Top 0.254: U1.7 30.6,20.95 29.98,21.56 v29.98,25.81
  Bottom 0.254: v29.98,25.81 29.39,26.41 29.39,39.07 20.78,47.68 20.78,57.76 20.21,58.33 17.56,58.33 16.48,59.41 U$1.38
CLK
  Top 0.254: J4.9 9.88,24.46 12.57,27.15 12.57,37.34 13.17,37.94 16.82,37.94 17.69,38.81 17.69,41 18.4,41.71 U$1.23
  Bottom 0.254: J12.5 15.1,49.05 15.38,48.77 15.38,43.49 16.05,42.81 16.94,42.81 18.05,41.71 U$1.23
CS
  Top 0.254: J4.7 9.8,27 11.46,28.65 11.46,41.05 12.12,41.71 U$1.24
  Bottom 0.254: J12.4 14.68,46.51 14.97,46.22 14.97,42.64 15.21,42.41 15.79,42.41 U$1.24
CTRL
  Top 0.254: J4.16 6.76,18.11 9.22,18.11 15.34,24.23 15.34,29.78 15.8,30.24 17.7,30.24 19.01,31.55 U$1.15
GND  (via drill 0.35)
  Top 0.203: U1.6 32.19,20.3 v31.01,19.13 29.84,20.3 U1.11
  other vias: 33.43,53.67 37.24,53.67 37.24,49.86 33.43,49.86 25.81,46.05 33.43,38.43 37.24,38.43 25.81,38.43 25.81,33.35 33.43,33.35 37.24,33.35 44.86,49.86 48.67,49.86 52.48,49.86 56.29,49.86 56.29,46.05 52.48,46.05 48.67,46.05 44.86,46.05 44.86,42.24 48.67,42.24 52.48,42.24 56.29,42.24 56.29,38.43 52.48,38.43 48.67,38.43 44.86,38.43 52.48,34.62 56.29,34.62 60.1,46.05 63.91,46.05 63.91,42.24 60.1,42.24 60.1,38.43 63.91,38.43 63.91,34.62 60.1,34.62 67.72,34.62 71.53,34.62 63.91,30.81 67.72,30.81 63.91,27 63.91,23.19 60.1,20.65 56.29,30.81 52.48,30.81 48.67,30.81 52.48,27 56.29,27 48.67,27 48.67,21.92 52.48,21.92 48.67,18.11 52.48,18.11 48.67,14.3 52.48,14.3 56.29,14.3 56.29,18.11 60.1,14.3 63.91,14.3 67.72,14.3 77.88,14.3 77.88,18.11 77.88,21.92 77.88,48.59 77.88,52.4 77.88,56.21 77.88,60.02 77.88,63.83 77.88,67.64 77.88,71.45 77.88,10.49 77.88,6.68 77.88,2.87 74.07,2.87 70.26,2.87 70.26,6.68 70.26,10.49 74.07,10.49 74.07,6.68 66.45,2.87 36.42,6.88 44.86,14.3 44.86,18.11 41.05,18.11 41.05,14.3 37.24,27 33.43,27 27.71,27.64 25.81,24.46 25.27,17.78 25.81,7.95 11.84,2.87 8.03,2.87 8.03,6.68 4.22,10.49 2.9,27.81 2.95,30.81 2.95,34.62 9.3,54.94 9.3,58.75 32.16,9.22 35.97,9.22 34.7,2.87 36.91,2.84 63.91,20.65 74.07,44.78 70.26,44.78 70.26,42.24 74.07,52.4 70.26,52.4 74.07,60.02 70.26,60.02 74.07,63.83 70.26,63.83 74.07,67.64 70.26,67.64 70.26,71.45 74.07,71.45 58.83,67.64 55.02,67.64 51.21,67.64 47.4,67.64 43.59,67.64 51.21,62.56 55.02,62.56 55.02,57.48 51.21,57.48 47.4,57.48 43.59,57.48 66.45,60.02 66.45,63.83 37.24,61.29 33.43,61.29 37.24,58.12 33.43,58.24 39.78,67.64 35.97,67.64 32.16,67.64 28.35,67.64 24.54,67.64 14.38,67.64 10.57,67.64 6.76,67.64 2.95,67.64 2.95,63.83 6.25,61.29 10.62,49.78 14.48,18.9 13.64,36.5 12.27,18.47
  pour Top (isolate 0.254, rank 6): -2.81,82.56 81.51,82.56 87.8,76.28 87.8,-0.41 80.95,-7.25 -6.85,-7.25 -10.66,-3.44 -10.66,74.59 -2.81,82.44
  pour Bottom (isolate 0.254, rank 6): -6.65,81.98 -1.75,86.88 83.63,86.88 91.64,78.87 91.64,-3.23 82.92,-11.95 80.82,-11.95 -10.85,-11.95 -16.61,-6.18 -16.61,72.06 -6.69,81.98
GPIO_1
  Top 0.254: J4.1 8.43,35.03 8.43,56.46 8.92,56.95 U$1.36
GPIO_2
  Top 0.254: J4.13 9.42,19.38 14.78,24.74 14.78,31.24 15.09,31.55 U$1.16
GPIO_3
  Top 0.254: J4.14 6.99,20.88 10.06,20.88 14.24,25.06 14.24,33.82 14.5,34.09 U$1.18
GPIO_4
  Top 0.254: J4.10 6.86,25.83 9.6,25.83 12.01,28.25 12.01,38.61 12.57,39.17 U$1.22
GPIO_5
  Top 0.254: J4.8 6.99,28.5 8.46,28.5 10.91,30.95 10.91,43.36 11.8,44.25 U$1.26
GPIO_6
  Top 0.254: J4.6 6.99,31.04 8.46,31.04 9.73,32.31 9.73,50.14 10.35,50.76 16.94,50.76 18.05,51.87 U$1.31
GPIO_7
  Top 0.254: J4.5 10.33,31.84 10.33,47.55 11,48.22 16.94,48.22 18.05,49.33 U$1.29
GPIO_8
  Top 0.254: J4.18 6.99,15.8 8.46,15.8 12.79,20.13 18.77,20.13 19.02,20.38 U$1.7
IMU_INT
  Top 0.254: U$1.13 41.41,29.01 42.01,29.62 56.54,29.62 U$2.INT
IMU_INT_2
  Top 0.254: U$1.35 39.4,56.95 40.12,56.22 40.12,48.98 40.53,48.58 U$3.INT
IMU_RESET  (via drill 0.35)
  Top 0.254: U$1.11 31.2,26.47 v31.79,25.88
  Bottom 0.254: v31.79,25.88 31.79,23.53 32.03,23.29 38.15,23.29 40.67,20.78 U$2.RST
IMU_RESET_2
  Top 0.254: U$3.RST 57.81,55.45 57.81,58.73 56.58,59.96 41.19,59.96 40.72,59.49 U$1.37
LEAK
  Bottom 0.254: U$1.32 6.58,51.87 5.78,52.67 5.78,58.48 5.51,58.75 JP1.1
MISO
  Top 0.254: J4.12 6.81,23.24 10.85,23.24 13.13,25.53 13.13,35.03 13.63,35.52 16.94,35.52 17.59,36.17 17.59,37.73 U$1.21
  Bottom 0.254: J12.3 7.09,42.58 13.61,42.58 13.88,42.32 13.88,41.17 14.66,40.4 18.34,40.4 19.02,39.71 U$1.21
MOSI  (via drill 0.35)
  Top 0.254: J4.11 10.31,21.92 13.69,25.3 13.69,34.54 13.97,34.82 v15.01,34.82
  Bottom 0.254: J12.2 6.73,40.4 13.41,40.4 13.65,40.16 13.65,37.71 15.01,36.35 v15.01,34.82 15.49,34.82 15.88,35.2 17.6,35.2 U$1.19
N$1
  Top 0.254: U1.4 33.14,19.02 34.08,19.02 34.46,18.64 34.46,17.35 34.57,17.23 JP5.1
N$2
  Top 0.254: U1.5 34.4,19.65 34.46,19.65 34.63,19.82 35.55,19.82 JP8.1
N$6
  Top 0.508: 5V_EXT.A R1.1
N$7
  Top 0.508: 5V_LED.A R15.1
N$9
  Top 0.508: 3V_LED.A 39.14,13.47 R16.1
N$17
  Top 0.508: JP7.2 U$2.ADR
RX
  Bottom 0.254: J9.2 16.1,2.96 13.09,5.97 13.09,21.11 15.91,23.93 U$1.10
SALERT
  Top 0.254: J4.3 9.08,33.13 9.08,52.81 9.49,53.21 17.83,53.21 U$1.33
  Bottom 0.305: R2.1 J4.3
SCL  (via drill 0.35)
  Top 0.254: U$1.5 19.02,17.83 18.85,17.65 11.38,17.65 J4.17 | v20.75,19.99 20.75,21.49 20.87,21.6 U1.9 27.39,23.64 27.76,24 v29.12,24 | J3.2 74.77,37.93 J11.3 | J6.3 67.93,20.34 67.69,20.57 v67.69,28.16 | v66.84,52.99 68.32,52.99 J5.3 | v30.91,24 v32.48,24 | v37.76,24 41.83,24 U$2.SCL
  Bottom 0.254: U$1.5 20.96,18.85 R12.1 20.75,19.05 v20.75,19.99 | v67.69,28.16 68.04,28.51 J1.2 71.3,29.45 J7.2 76.64,29.45 76.99,29.79 76.99,37.36 76.84,37.52 J11.3 | J3.2 66.56,37.93 65.98,38.52 65.98,52.42 66.55,52.99 v66.84,52.99 66.84,54.64 66.56,54.92 59.11,54.92 57.81,53.62 41.86,53.62 | 41.86,53.62 U$3.SCL | U$2.SCL 38.95,23.32 38.66,23.61 38.66,52.67 39.61,53.62 41.86,53.62 | v29.12,24 v30.91,24 | v32.48,24 v37.76,24
SDA  (via drill 0.35)
  Top 0.254: J4.19 11.33,15.06 18.78,15.06 19.02,15.3 U$1.3 | U$2.SDA 33.44,25.86 33.13,25.55 U1.8 v31.54,21.6 v31.53,21.61 | J6.4 69,29.32 69.45,29.76 J1.3 | J5.4 66.19,54.29 v65.54,53.65 | J7.3 75.96,31.99 76.5,32.54 76.5,38.74 J11.2 72.04,40.06 71.17,39.18 J3.3 69.27,39.18 68.19,40.26 65.12,40.26 v64.94,40.45 | v25.83,20.23 24.05,20.23 23.66,19.84 23.66,18.17 23.38,17.89 21.16,17.89 v20.75,17.49
  Bottom 0.254: U$1.3 R11.1 21.02,17.22 v20.75,17.49 | J1.3 71.02,29.76 72.23,30.98 74.04,30.98 J7.3 | v64.94,40.45 64.94,53.04 v65.54,53.65 61.47,53.65 60.16,52.34 58.84,52.34 57.62,51.12 U$3.SDA 39.76,51.12 39.28,50.64 39.28,26.78 40.21,25.86 U$2.SDA | v25.83,20.23 25.9,20.17 31.19,20.17 31.52,20.5 31.52,21.6 v31.53,21.61
TX
  Bottom 0.254: U$1.8 17.11,21.39 17.73,20.76 17.73,13.03 18.09,12.68 20.23,12.68 20.42,12.48 20.42,4.1 J9.3
VS  (via drill 0.35)
  Top 0.508: U1.10 28.97,20.95 v28.98,20.97 | v35.59,21.84 35.59,20.63 JP8.2 36.83,20.61 37.16,20.28 37.16,17.68 36.72,17.23 JP5.2 36.02,17.18 36.02,15.47 v35.75,15.2
  Bottom 0.508: C5.2 29.53,12.05 U2.2 U2.4 35.75,12.05 v35.75,15.2 | v35.59,21.84 35.57,21.86 35.57,22.35 35.26,22.67 29.54,22.67 28.98,22.11 v28.98,20.97

### Text on the board
tPlace: X16 Pi ShieldSahil Mitra; / Leads: Danial, Minh, Raghav, Vijay | SA0 | GND | LEAK | Alert | IMU Reset New | SOL1 | IMU Int New | 3V3 | BNO080 | GND | GND | SAlert | LEAK | SOL6 | CLK | GND | SOL7 | CS | MISO | SOL5 | GND | GND | MOSI | CS | CLK | SDA | GND | SOL4 | MISO | SCL | GND | MOSI | 3V3 | SOL3 | 3.3V | SDA | SOL2 | CTRL | GND | IMU Int Old | SCL | GND | SA1 | IMU Reset | RX | GND | BNO055 | TX | SOL8 | GND | SCL | 5V | SDA | 5V | 3.3V | 5VEXT | 5V | 3.3V | GND | GND | RX | TX | 3V3 | GND | 3V3 | GND | GND | C:/Users/Minh/Downloads/1-victoria-royale-pegatina.bmp
tFinish: C:/Users/Minh/Downloads/bc13a8a0-138e-4d12-b07c-a789e0a8028b-profile_banner-480.bmp